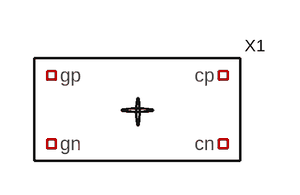
[diagram p0: schematic Draft1.asc]
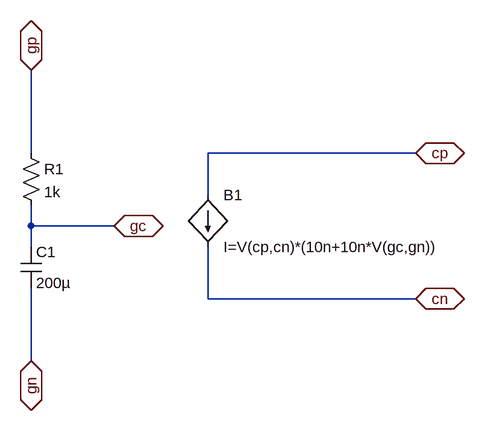
[diagram p1: sub-circuit modelcapteur.asc]
Draft1.asc, the LTspice schematic file:
Version 4
SHEET 1 880 680
SYMBOL Modelcapteur 240 160 R0
SYMATTR InstName X1

modelcapteur.asc, the sub-circuit schematic file:
Version 4
SHEET 1 880 680
WIRE -112 48 -112 -80
WIRE 480 48 160 48
WIRE 160 112 160 48
WIRE -112 160 -112 128
WIRE 16 160 -112 160
WIRE -112 192 -112 160
WIRE 160 272 160 192
WIRE 480 272 160 272
WIRE -112 368 -112 256
FLAG 480 48 cp
IOPIN 480 48 BiDir
FLAG 480 272 cn
IOPIN 480 272 BiDir
FLAG -112 -80 gp
IOPIN -112 -80 BiDir
FLAG -112 368 gn
IOPIN -112 368 BiDir
FLAG 16 160 gc
IOPIN 16 160 BiDir
SYMBOL bi 160 112 R0
SYMATTR InstName B1
SYMATTR Value I=V(cp,cn)*(10n+10n*V(gc,gn))
SYMBOL res -128 32 R0
SYMATTR InstName R1
SYMATTR Value 1k
SYMBOL cap -128 192 R0
SYMATTR InstName C1
SYMATTR Value 200µ

The netlist it stands for:
* Draft1.asc
XX1 NC_01 NC_02 NC_03 NC_04 modelcapteur

* block symbol definitions
.subckt modelcapteur cp cn gp gn
B1 cp cn I=V(cp,cn)*(10n+10n*V(gc,gn))
R1 gp gc 1k
C1 gc gn 200µ
.ends modelcapteur

.backanno
.end